# EAGLE design schematic (EAGLE 9.2.2)
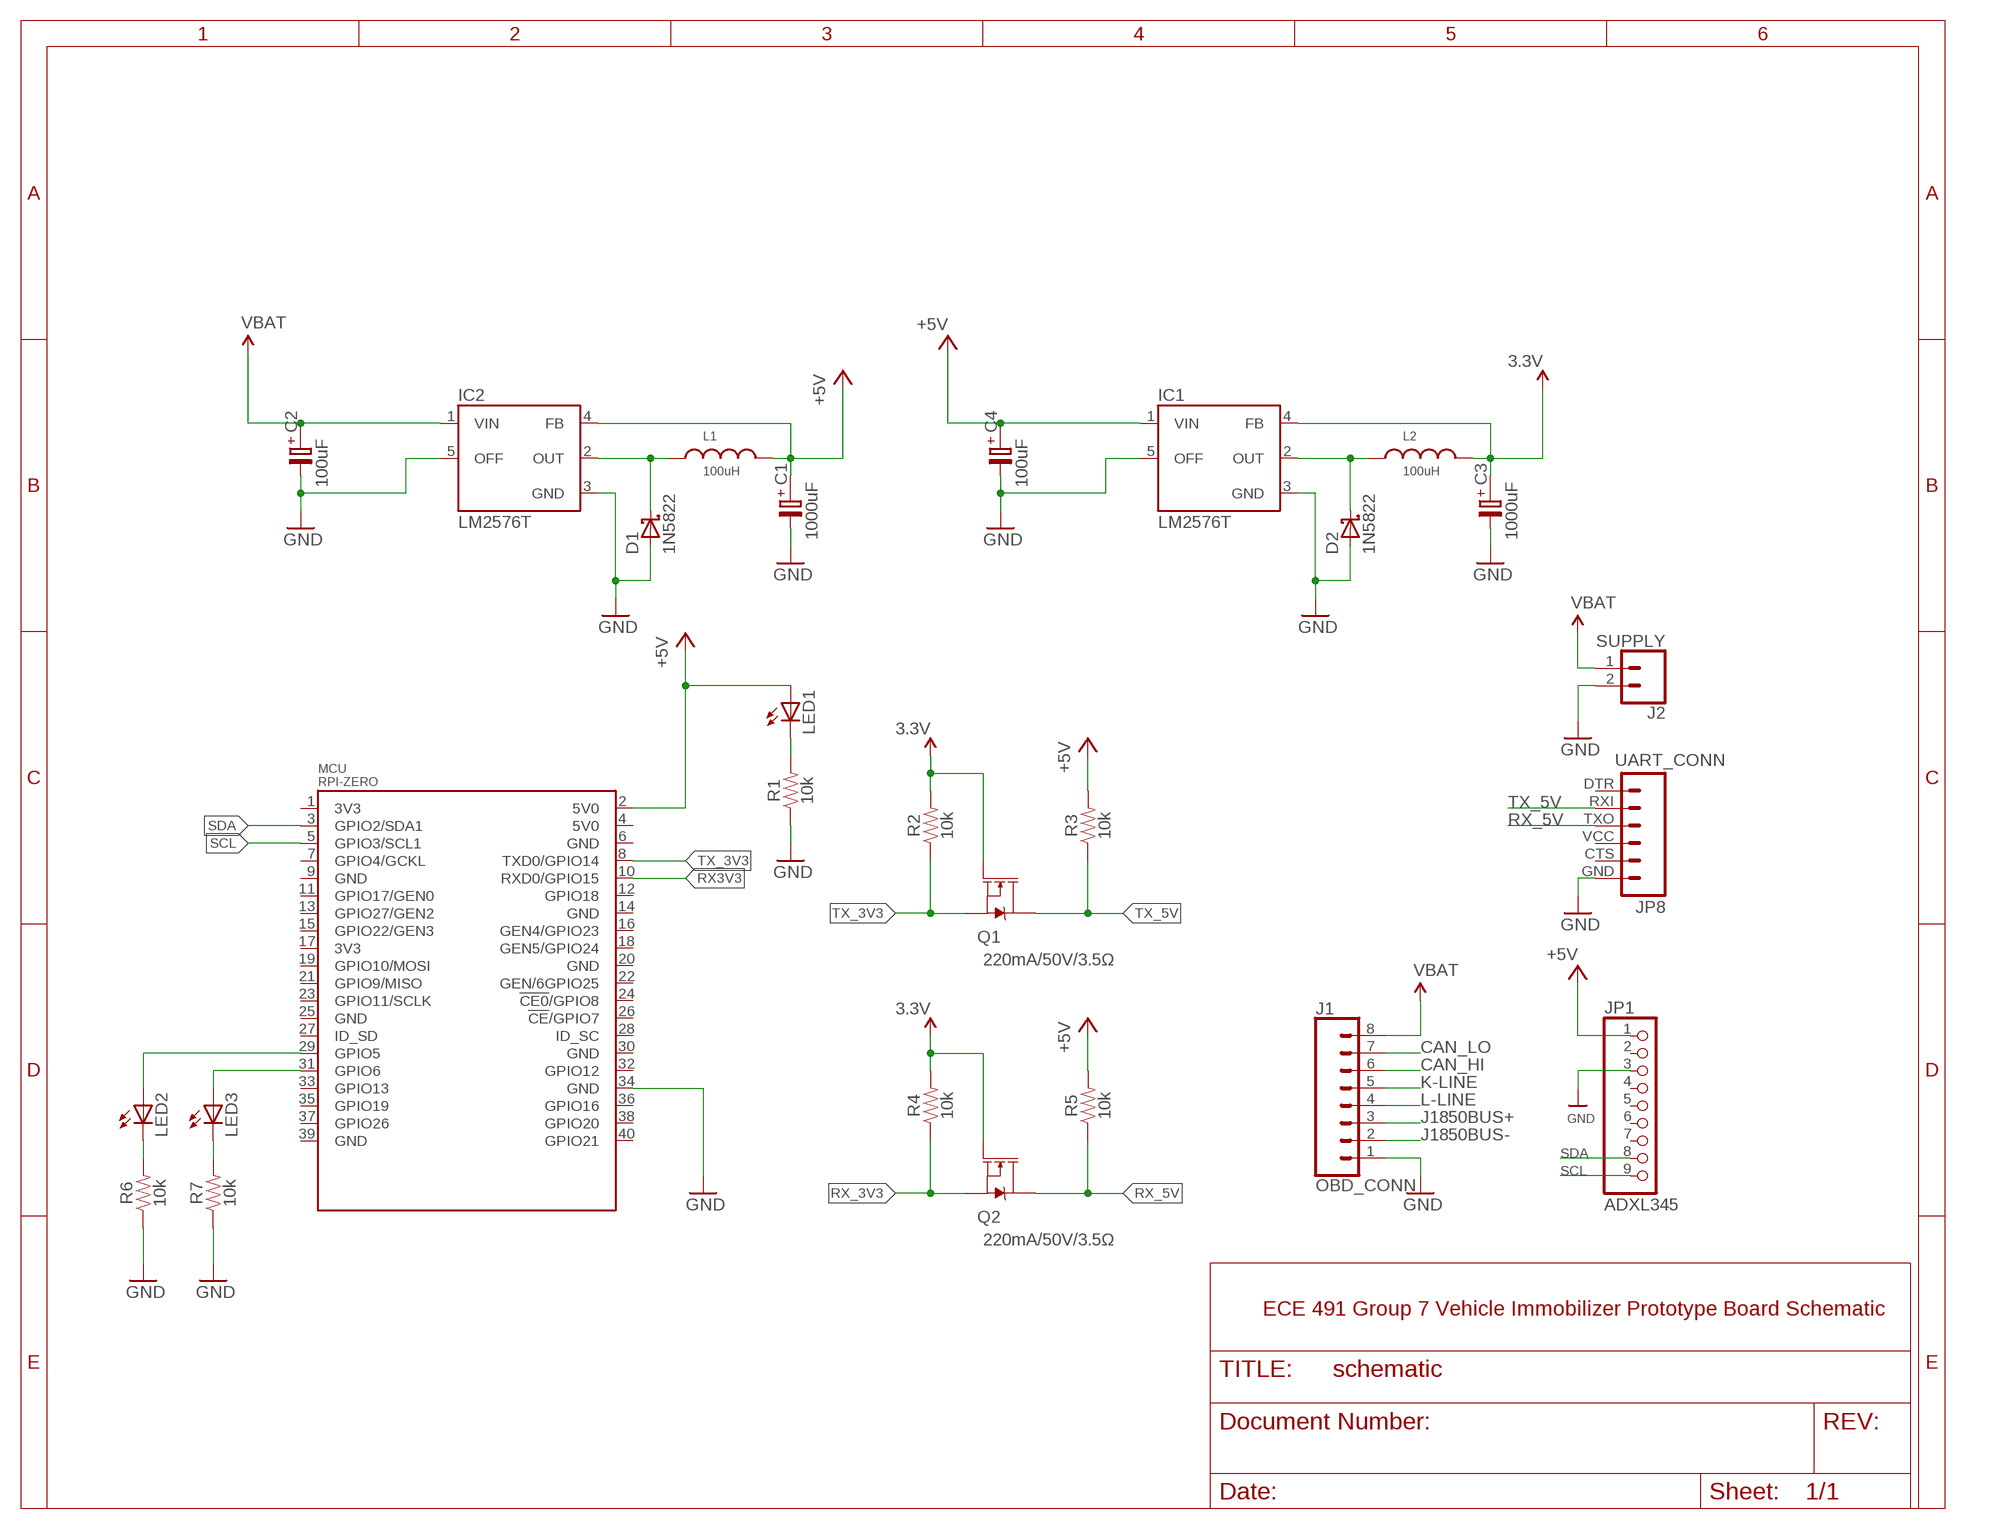
[diagram p0: schematic, sheet 1]

## Parts
C1  1000uF  C-PR-3,5X8  [E3,5-8]
C2  100uF  C-PR-3,5X8  [E3,5-8]
C3  1000uF  C-PR-3,5X8  [E3,5-8]
C4  100uF  C-PR-3,5X8  [E3,5-8]
D1  1N5822  [DIOAD2120W130L950D530P]
D2  1N5822  [DIOAD2120W130L950D530P]
IC1  LM2576T  [TO220-5]
IC2  LM2576T  [TO220-5]
J1  OBD_CONN  CONN_08"  [1X08]
J2  SUPPLY  CONN_02POLAR  [MOLEX-1X2]
JP1  ADXL345  HEADER-1X970MIL  [1X09_ROUND_70]
JP8  UART_CONN  FTDI_BASICPTH  [FTDI_BASIC]
L1  100uH  WE-TI_1014_7447480101  [WE-TI_1014]
L2  100uH  WE-TI_1014_7447480101  [WE-TI_1014]
LED1  LED3MM  [LED3MM]
LED2  LED3MM  [LED3MM]
LED3  LED3MM  [LED3MM]
MCU  RPI-ZERO  [RASPBERRYPI_BASTELSTUBE_V13_RASPI_BOARD_B+_FULL]
Q1  220mA/50V/3.5Ω  MOSFET-NCH-BSS138  [SOT23-3]
Q2  220mA/50V/3.5Ω  MOSFET-NCH-BSS138  [SOT23-3]
R1  10k  10KOHM-HORIZ-1/4W-5%  [AXIAL-0.3]
R2  10k  10KOHM-HORIZ-1/4W-5%  [AXIAL-0.3]
R3  10k  10KOHM-HORIZ-1/4W-5%  [AXIAL-0.3]
R4  10k  10KOHM-HORIZ-1/4W-5%  [AXIAL-0.3]
R5  10k  10KOHM-HORIZ-1/4W-5%  [AXIAL-0.3]
R6  10k  10KOHM-HORIZ-1/4W-5%  [AXIAL-0.3]
R7  10k  10KOHM-HORIZ-1/4W-5%  [AXIAL-0.3]

## Nets
3.3V: C3.+ IC1.4(FB) L2.2 Q1.1(G) Q2.1(G) R2.P$2 R4.P$2
+5V [power]: C1.+ C4.+ IC1.1(VIN) IC2.4(FB) JP1.1 L1.2 LED1.A MCU.2(5V0) R3.P$2 R5.P$2
CAN_HI: J1.6
CAN_LO: J1.7
GND [power]: C1.- C2.- C3.- C4.- D1.A D2.A IC1.3(GND) IC1.5(OFF) IC2.3(GND) IC2.5(OFF) J1.1 J2.2 JP1.3 JP8.GND MCU.34(GND) R1.P$1 R6.P$1 R7.P$1
J1850BUS+: J1.3
J1850BUS-: J1.2
K-LINE: J1.5
L-LINE: J1.4
N$1: D2.C IC1.2(OUT) L2.1
N$2: LED2.A MCU.29(GPIO5)
N$3: LED3.A MCU.31(GPIO6)
N$4: D1.C IC2.2(OUT) L1.1
N$5: LED2.K(C) R6.P$2
N$6: LED3.K(C) R7.P$2
N$9: LED1.K(C) R1.P$2
RX3V3: MCU.10(RXD0/GPIO15)
RX_3V3: Q2.2(S) R4.P$1
RX_5V: JP8.TXO Q2.3(D) R5.P$1
SCL: JP1.9 MCU.5(GPIO3/SCL1)
SDA: JP1.8 MCU.3(GPIO2/SDA1)
TX_3V3: MCU.8(TXD0/GPIO14) Q1.2(S) R2.P$1
TX_5V: JP8.RXI Q1.3(D) R3.P$1
VBAT [power]: C2.+ IC2.1(VIN) J1.8 J2.1
Unconnected: JP1.2 JP1.4 JP1.5 JP1.6 JP1.7 JP8.CTS JP8.DTR JP8.VCC MCU.1(3V3) MCU.4(5V0) MCU.6(GND) MCU.7(GPIO4/GCKL) MCU.9(GND) MCU.11(GPIO17/GEN0) MCU.12(GPIO18) MCU.13(GPIO27/GEN2) MCU.14(GND) MCU.15(GPIO22/GEN3) MCU.16(GEN4/GPIO23) MCU.17(3V3) MCU.18(GEN5/GPIO24) MCU.19(GPIO10/MOSI) MCU.20(GND) MCU.21(GPIO9/MISO) MCU.22(GEN/6GPIO25) MCU.23(GPIO11/SCLK) MCU.24(!CE0!/GPIO8) MCU.25(GND) MCU.26(!CE!/GPIO7) MCU.27(ID_SD) MCU.28(ID_SC) MCU.30(GND) MCU.32(GPIO12) MCU.33(GPIO13) MCU.35(GPIO19) MCU.36(GPIO16) MCU.37(GPIO26) MCU.38(GPIO20) MCU.39(GND) MCU.40(GPIO21)

## Notes on the sheet
- ECE 491 Group 7 Vehicle Immobilizer Prototype Board Schematic

## Library data of the parts
C1-C4 = cap-pan40:C-PR: POLARIZED ELECTROLYTIC/TANTALUM
D1 D2 = 1N5822:1N5822: 1N5822 Series 40 V 3 A Through Hole Schottky Rectifier - DO-201AD; AVAILABILITY: Unavailable; MF: ON Semiconductor; MP: 1N5822; PACKAGE: DO-201AD-201 CDIL; PRICE: None
IC1 IC2 = v-reg-3:LM2576: National Semiconductor <http://www.national.com> 3.0A "Simple Switcher"(c) 52kHz, Vout 1.23-37V (HV: 57V), Vin 40V (HV: 60V), 50µA standby current
J1 = SparkFun-Connectors:CONN_08: Multi connection point. Often used as Generic Header-pin footprint for 0.1 inch spaced/style header connections On any of the 0.1 inch spaced packages, you can populate with these: Break Away Headers - Straight <https://www.sparkfun.com/products/116> (PRT-00116) Break Away Male Headers - Right Angle <https://www.sparkfun.com/products/553> (PRT-00553) Female Headers <https://www.sparkfun.com/products/115> (PRT-00115) Break Away Headers - Machine Pin <https://www.sparkfun.com/products/117> (PRT-00117) Break Away Female Headers - Swiss Machine Pin <https://www.sparkfun.com/products/743> (PRT-00743) Arduino Stackable Header - 8 Pin <https://www.sparkfun.com/products/9279> (PRT-09279) For SCREWTERMINALS and SPRING TERMINALS visit here: Screw Terimnals on SparkFun.com <https://www.sparkfun.com/search/results?term=Screw+Terminals> (5mm/3.5mm/2.54mm spacing) This device is also useful as a general connection point to wire up your design to another part of your project. Our various solder wires solder well into these plated through hole pads. Hook-Up Wire - Assortment (Stranded, 22 AWG) <https://www.sparkfun.com/products/11375> (PRT-11375) Hook-Up Wire - Assortment (Solid Core, 22 AWG) <https://www.sparkfun.com/products/11367> (PRT-11367) View the entire wire category on our website here <https://www.sparkfun.com/categories/141> Special notes: Molex polarized connector foot print use with SKU : PRT-08231 with associated crimp pins and housings. 1MM SMD Version SKU: PRT-10208 NOTES ON THE VARIANTS LOCK and LOCK_LONGPADS... This footprint was designed to help hold the alignment of a through-hole component (i.e. 6-pin header) while soldering it into place. You may notice that each hole has been shifted either up or down by 0.005 of an inch from it's more standard position (which is a perfectly straight line). This slight alteration caused the pins (the squares in the middle) to touch the edges of the holes. Because they are alternating, it causes a "brace" to hold the component in place. 0.005 has proven to be the perfect amount of "off-center" position when using our standard breakaway headers. Although looks a little odd when you look at the bare footprint, once you have a header in there, the alteration is very hard to notice. Also,if you push a header all the way into place, it is covered up entirely on the bottom side.; PROD_ID: CONN-08438
J2 = SparkFun-Connectors:CONN_02: Multi connection point. Often used as Generic Header-pin footprint for 0.1 inch spaced/style header connections On any of the 0.1 inch spaced packages, you can populate with these: Break Away Headers - Straight <https://www.sparkfun.com/products/116> (PRT-00116) Break Away Male Headers - Right Angle <https://www.sparkfun.com/products/553> (PRT-00553) Female Headers <https://www.sparkfun.com/products/115> (PRT-00115) Break Away Headers - Machine Pin <https://www.sparkfun.com/products/117> (PRT-00117) Break Away Female Headers - Swiss Machine Pin <https://www.sparkfun.com/products/743> (PRT-00743) For SCREWTERMINALS and SPRING TERMINALS visit here: Screw Terimnals on SparkFun.com <https://www.sparkfun.com/search/results?term=Screw+Terminals> (5mm/3.5mm/2.54mm spacing) This device is also useful as a general connection point to wire up your design to another part of your project. Our various solder wires solder well into these plated through hole pads. Hook-Up Wire - Assortment (Stranded, 22 AWG) <https://www.sparkfun.com/products/11375> (PRT-11375) Hook-Up Wire - Assortment (Solid Core, 22 AWG) <https://www.sparkfun.com/products/11367> (PRT-11367) View the entire wire category on our website here <https://www.sparkfun.com/categories/141> Special notes: Molex polarized connector foot print use with: PRT-08233 with associated crimp pins and housings. 2.54_SCREWTERM for use with PRT-10571. 3.5mm Screw Terminal footprints for PRT-08084 5mm Screw Terminal footprints for use with PRT-08432; SF_ID: PRT-09918
JP1 = microbuilder:HEADER-1X9: PIN HEADER
JP8 = SparkFun:FTDI_BASIC: FTDI Basic: 3.3V and 5V
L1 L2 = PowerMagnetics:WE-TI_1014: Radial Leaded Wire Wound Inductor Characteristics Radial through-hole inductor High saturation core material Small size Maximum current up to 8.5 A Custom design on request Applications Signal filtering Switches, switching power supply for small and medium voltage Power supply filter EMI filter <http://katalog.we-online.de/media/images/v2/we-ti_tonneninduktivitaet.jpg> Details see: http://katalog.we-online.de/en/pbs/WE-TI? Updated by Dan Xu 2014-07-11 2014 (C) Wurth Elektronik; WE-NUMBER: 7447480101/100uH
LED1-LED3 = adafruit:LED: LED OSRAM: - CHIPLED LG R971, LG N971, LY N971, LG Q971, LY Q971, LO R971, LY R971 LH N974, LH R974 LS Q976, LO Q976, LY Q976 LO Q996 - Hyper CHIPLED LW Q18S LB Q993, LB Q99A, LB R99A - SideLED LS A670, LO A670, LY A670, LG A670, LP A670 LB A673, LV A673, LT A673, LW A673 LH A674 LY A675 LS A676, LA A676, LO A676, LY A676, LW A676 LS A679, LY A679, LG A679 - Hyper Micro SIDELED® LS Y876, LA Y876, LO Y876, LY Y876 LT Y87S - SmartLED LW L88C, LW L88S LB L89C, LB L89S, LG L890 LS L89K, LO L89K, LY L89K LS L896, LA L896, LO L896, LY L896 - TOPLED LS T670, LO T670, LY T670, LG T670, LP T670 LSG T670, LSP T670, LSY T670, LOP T670, LYG T670 LG T671, LOG T671, LSG T671 LB T673, LV T673, LT T673, LW T673 LH T674 LS T676, LA T676, LO T676, LY T676, LB T676, LH T676, LSB T676, LW T676 LB T67C, LV T67C, LT T67C, LS T67K, LO T67K, LY T67K, LW E67C LS E67B, LA E67B, LO E67B, LY E67B, LB E67C, LV E67C, LT E67C LW T67C LS T679, LY T679, LG T679 LS T770, LO T770, LY T770, LG T770, LP T770 LB T773, LV T773, LT T773, LW T773 LH T774 LS E675, LA E675, LY E675, LS T675 LS T776, LA T776, LO T776, LY T776, LB T776 LHGB T686 LT T68C, LB T68C - Hyper Mini TOPLED® LB M676 - Mini TOPLED Santana® LG M470 LS M47K, LO M47K, LY M47K Source: http://www.osram.convergy.de/
MCU = RPI-Zero:RPI-ZERO
Q1 Q2 = SparkFun-DiscreteSemi:MOSFET-NCH: N-channel MOSFETs Voltage controlled devices that allow control of high current outputs. SparkFun Products: SparkFun OpenScale <https://www.sparkfun.com/products/13261> SparkFun Digital Sandbox <https://www.sparkfun.com/products/12651> SparkFun Monster Moto Shield <https://www.sparkfun.com/products/10182> SparkFun MOSFET Power Controller <https://www.sparkfun.com/products/11214>; PROD_ID: TRANS-00830
R1-R7 = SparkFun-Resistors:10KOHM: 10kΩ resistor A resistor is a passive two-terminal electrical component that implements electrical resistance as a circuit element. Resistors act to reduce current flow, and, at the same time, act to lower voltage levels within circuits. - Wikipedia; PROD_ID: RES-09435

## Net classes
0 default: width 0.305 mm, drill 0.508 mm, clearance 0.305 mm
1 power: width 1.27 mm, drill 0.508 mm, clearance 0.508 mm

## Board
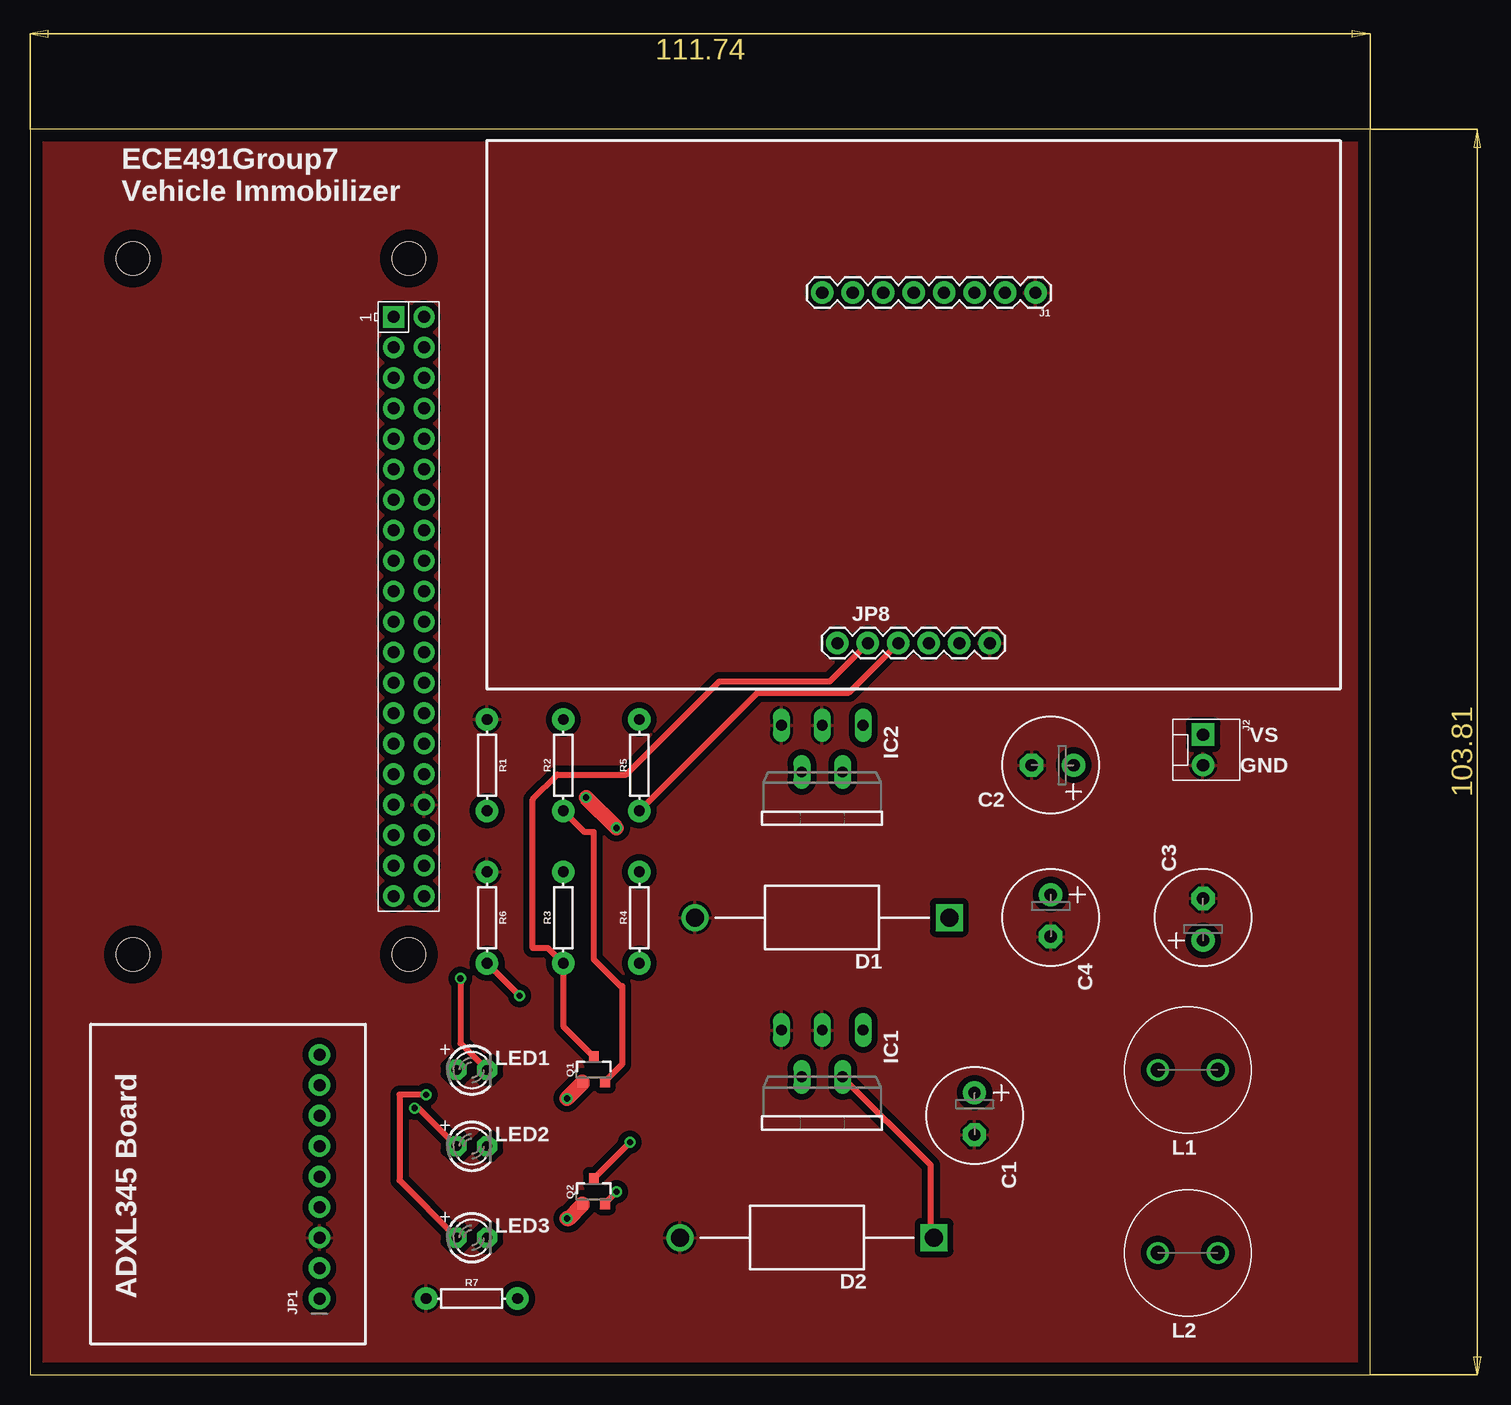
[diagram p1: board, top side]
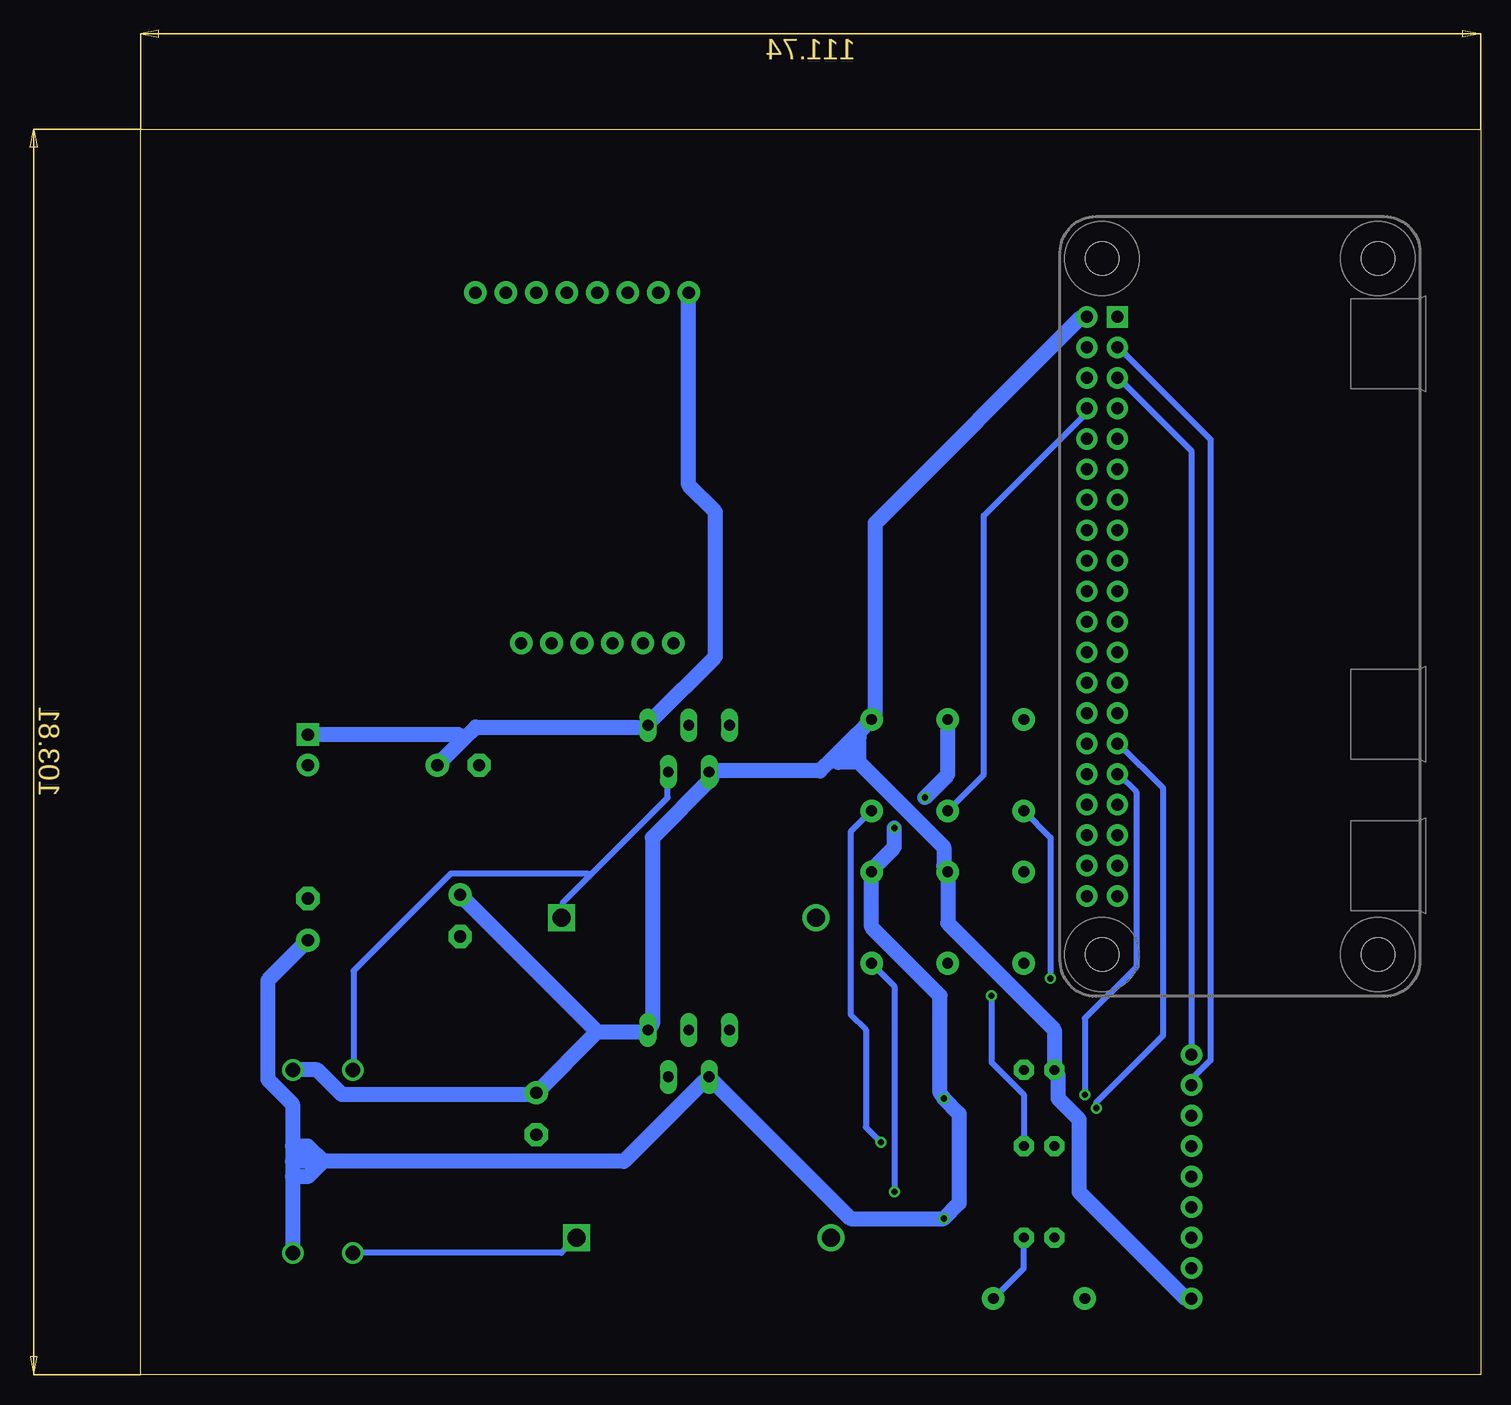
[diagram p2: board, bottom side, seen from below]

Size 111.74 x 103.81 mm. Coordinates in mm from the lower left corner, seen from the top.
Outline: 0,0 111.74,0 111.74,103.81 0,103.81 0,0
Copper layers (1*16): Top 0.035mm / dielectric 1.5mm / Bottom 0.035mm
Design rules "default *": minimum track width 6mil, minimum drill 0.35mm, track to track 6mil, track to pad 6mil, pad to pad 6mil, via to via 6mil, smd to smd 6mil, copper to edge 40mil, drill to drill 6mil, minimum pad ring 10mil, minimum via ring 8mil, stop-mask expansion 4mil, vias tented up to drill 0mil, thermal gap 10mil

### Footprints (pad centres in the part's own frame; a part is rotated, then mirrored left to right if it is on the bottom)
E3,5-8 = drill 1.016 pad 1.93: + -1.905,0 | drill 1.016 pad 1.93 octagon: - 1.587,0
DIOAD2120W130L950D530P = drill 1.5 pad 2.25: A 10.6,0 | drill 1.5 pad 2.25 square: C -10.6,0
TO220-5 = drill 0.9 long: 1 -3.4,-8.4; 2 -1.7,-4.5; 3 0,-8.4; 4 1.7,-4.5; 5 3.4,-8.4
1X08 = drill 1.016 pad 1.88: 1 0,0; 2 2.54,0; 3 5.08,0; 4 7.62,0; 5 10.16,0; 6 12.7,0; 7 15.24,0; 8 17.78,0
MOLEX-1X2 = drill 1.016 pad 1.88 square: 1 0,0 | drill 1.016 pad 1.88: 2 2.54,0
1X09_ROUND_70 = drill 1 pad 1.778: 1 -10.16,0; 2 -7.62,0; 3 -5.08,0; 4 -2.54,0; 5 0,0; 6 2.54,0; 7 5.08,0; 8 7.62,0; 9 10.16,0
FTDI_BASIC = drill 1.016 pad 1.88: CTS 10.16,0; DTR 0,0; GND 12.7,0; RXI 2.54,0; TXO 5.08,0; VCC 7.62,0
WE-TI_1014 = drill 1.2: 1 -2.5,0; 2 2.5,0
LED3MM = drill 0.813 pad 1.676 octagon: A -1.27,0; K 1.27,0
RASPBERRYPI_BASTELSTUBE_V13_RASPI_BOARD_B+_FULL = drill 1 pad 1.778 square: 1 8.37,25.23 | drill 1 pad 1.778: 2 8.37,27.77; 3 10.91,25.23; 4 10.91,27.77; 5 13.45,25.23; 6 13.45,27.77; 7 15.99,25.23; 8 15.99,27.77; 9 18.53,25.23; 10 18.53,27.77; 11 21.07,25.23; 12 21.07,27.77; 13 23.61,25.23; 14 23.61,27.77; 15 26.15,25.23; 16 26.15,27.77; 17 28.69,25.23; 18 28.69,27.77; 19 31.23,25.23; 20 31.23,27.77; 21 33.77,25.23; 22 33.77,27.77; 23 36.31,25.23; 24 36.31,27.77; 25 38.85,25.23; 26 38.85,27.77; 27 41.39,25.23; 28 41.39,27.77; 29 43.93,25.23; 30 43.93,27.77; 31 46.47,25.23; 32 46.47,27.77; 33 49.01,25.23; 34 49.01,27.77; 35 51.55,25.23; 36 51.55,27.77; 37 54.09,25.23; 38 54.09,27.77; 39 56.63,25.23; 40 56.63,27.77 | hole 2.75: 3.5,3.5; 3.5,26.5; 61.5,3.5; 61.5,26.5
SOT23-3 = smd 0.8 x 0.9: 1 -0.95,-1; 2 0.95,-1; 3 0,1.1
AXIAL-0.3 = drill 0.9 pad 1.88: P$1 -3.81,0; P$2 3.81,0

### Placement (x,y rotation side)
C1  78.74,21.59 270 top
C2  85.09,50.8 180 top
C3  97.79,38.1 90 top
C4  85.09,38.1 270 top
D1  66.04,38.1 180 top
D2  64.77,11.43 180 top
IC1  66.04,20.32 180 top
IC2  66.04,45.72 180 top
J1  83.82,90.17 180 top
J2  97.79,53.34 270 top
JP1  24.13,16.51 90 top
JP8  67.31,60.96 0 top
L1  96.52,25.4 0 top
L2  96.52,10.16 0 top
LED1  36.83,25.4 0 top
LED2  36.83,19.05 0 top
LED3  36.83,11.43 0 top
MCU  5.08,96.52 270 top
Q1  46.99,25.4 0 top
Q2  46.99,15.24 0 top
R1  38.1,50.8 270 top
R2  44.45,50.8 90 top
R3  44.45,38.1 90 top
R4  50.8,38.1 90 top
R5  50.8,50.8 90 top
R6  38.1,38.1 270 top
R7  36.83,6.35 0 top

### Tracks (layer width: path | path; a pad name or v marks a point on that pad's centre or on a via)
3.3V  (via drill 0.51)
  Top 1.27: v44.77,13.02 44.93,13.02 46.04,14.13 Q2.1 | v44.77,23.02 46.04,24.29 Q1.1 | v48.9,45.56 v46.35,48.1
  Bottom 1.27: 99.06,19.05 99.06,22.54 101.12,24.61 101.12,32.86 C3.+ | 99.06,19.05 99.06,17.78 | 99.06,17.78 99.06,16.51 | 99.06,16.51 99.06,10.16 L2.2 | R2.P$2 44.45,50.01 v46.35,48.1 | v48.9,45.56 48.9,43.97 50.48,42.39 R4.P$2 50.8,37.31 45.09,31.59 45.09,23.5 v44.77,23.02 43.5,21.75 43.5,14.29 v44.77,13.02 52.55,13.02 64.29,24.77 IC1.4 64.77,24.45 71.44,17.78 96.52,17.78 | 96.52,17.78 99.06,17.78 | 96.52,17.78 97.79,19.05 99.06,19.05 | 96.52,17.78 97.79,16.51 99.06,16.51
+5V
  Bottom 1.27: JP1.1 24.61,6.35 33.5,15.24 33.5,21.27 35.24,23.02 35.24,24.92 LED1.A 35.56,28.73 44.45,37.62 R3.P$2 44.77,42.39 44.77,43.97 51.83,51.04 | 73.66,28.57 69.53,28.57 IC1.1 69.06,29.21 69.06,44.77 64.14,49.69 IC2.4 64.29,50.32 55.09,50.32 53.98,51.44 | 73.66,28.57 C1.+ 79.22,23.34 94.93,23.34 97,25.4 L1.2 | 73.66,28.57 C4.+ | 52.07,53.34 R5.P$2 50.48,55.09 50.48,70.96 33.34,88.11 32.86,88.11 MCU.2 | 52.07,53.34 53.1,52.31 | 53.1,52.31 53.98,51.44 | 53.1,52.31 51.83,51.04 | 51.83,51.04 51.83,53.1 52.07,53.34 | 51.83,51.04 53.58,51.04 53.98,51.44
GND
  pour Top: 0,104.14 0,0 111.76,0 111.76,104.14
N$1
  Top 0.508: D2.C 75.09,11.43 75.09,17.46 67.79,24.77 IC1.2
  Bottom 0.508: L2.1 76.68,10.16 75.41,11.43 D2.C
N$2  (via drill 0.51)
  Top 0.508: LED2.A 32.38,22.23 v32.07,22.23
  Bottom 0.508: v32.07,22.23 32.07,22.7 26.51,28.26 26.51,48.9 30.16,52.55 MCU.29
N$3  (via drill 0.51)
  Top 0.508: LED3.A 30.8,16.19 30.8,23.34 v33.02,23.34
  Bottom 0.508: v33.02,23.34 33.02,29.69 28.73,33.97 28.73,48.58 30.16,50.01 MCU.31
N$4
  Bottom 0.508: 74.3,41.59 76.52,39.37 76.52,38.1 D1.C | 74.3,41.59 67.79,48.1 67.79,50.16 IC2.2 | L1.1 93.98,25.4 93.98,33.66 85.88,41.75 74.45,41.75 74.3,41.59
N$5  (via drill 0.51)
  Top 0.508: R6.P$2 v40.8,31.59
  Bottom 0.508: LED2.K 38.1,23.34 40.8,26.04 v40.8,31.59
N$6
  Bottom 0.508: LED3.K 38.1,8.89 R7.P$2
N$9  (via drill 0.51)
  Top 0.508: LED1.K 35.88,27.62 v35.88,33.02
  Bottom 0.508: v35.88,33.02 35.88,44.77 R1.P$2
RX_3V3  (via drill 0.51)
  Top 0.508: v48.9,15.24 47.94,14.29 Q2.2
  Bottom 0.508: v48.9,15.24 48.9,32.38 R4.P$1
RX_5V  (via drill 0.51)
  Top 0.508: v50.01,19.37 Q2.3 | JP8.TXO 68.26,56.83 60.64,56.83 R5.P$1
  Bottom 0.508: v50.01,19.37 51.28,20.64 51.28,28.73 52.55,30 52.55,45.24 R5.P$1
SCL
  Bottom 0.508: JP1.9 24.13,76.99 30.16,83.03 MCU.5
SDA
  Bottom 0.508: JP1.8 24.13,24.61 22.54,26.19 22.54,77.95 30.16,85.57 MCU.3
TX_3V3
  Top 0.508: R2.P$1 46.2,45.24 46.99,45.24 46.99,34.61 49.21,32.38 49.37,32.38 49.37,25.88 47.94,24.45 Q1.2
  Bottom 0.508: R2.P$1 41.43,50.01 41.43,71.6 32.86,80.17 32.86,80.49 MCU.8
TX_5V
  Top 0.508: Q1.3 44.45,29.05 R3.P$1 43.18,35.56 41.91,35.56 41.91,47.94 43.97,50.01 49.69,50.01 57.47,57.78 66.67,57.78 JP8.RXI
VBAT
  Bottom 1.27: C2.+ 84.85,52.94 | 84.85,52.94 83.82,53.98 69.53,53.98 IC2.1 69.06,54.61 63.82,59.85 63.82,71.91 66.04,74.14 J1.8 | J2.1 85.25,53.34 84.85,52.94

### Text on the board
tPlace: ECE491Group7 / Vehicle Immobilizer | ADXL345 Board
tNames: VS | GND